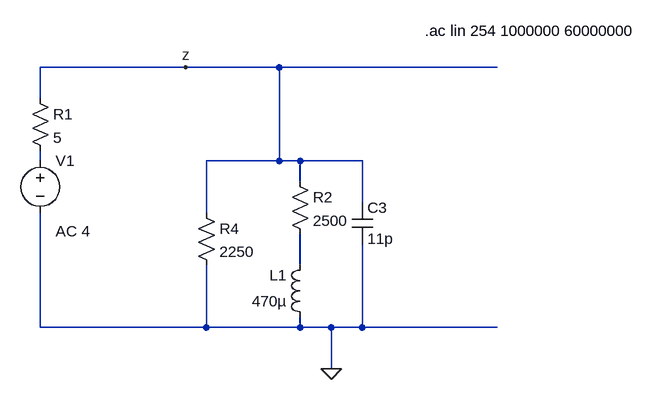
[diagram p0: schematic Output Port Model.asc]
Output Port Model.asc, the LTspice schematic file:
Version 4
SHEET 1 1108 884
WIRE 368 -80 144 -80
WIRE 512 -80 368 -80
WIRE 848 -80 512 -80
WIRE 144 -32 144 -80
WIRE 144 64 144 48
WIRE 512 64 512 -80
WIRE 512 64 400 64
WIRE 544 64 512 64
WIRE 640 64 544 64
WIRE 544 96 544 64
WIRE 640 128 640 64
WIRE 400 144 400 64
WIRE 544 224 544 176
WIRE 144 320 144 144
WIRE 400 320 400 224
WIRE 400 320 144 320
WIRE 544 320 544 304
WIRE 544 320 400 320
WIRE 592 320 544 320
WIRE 640 320 640 192
WIRE 640 320 592 320
WIRE 848 320 640 320
WIRE 592 384 592 320
FLAG 592 384 0
FLAG 368 -80 z
SYMBOL ind 560 320 R180
WINDOW 0 36 80 Left 2
WINDOW 3 36 40 Left 2
SYMATTR InstName L1
SYMATTR Value 470µ
SYMATTR SpiceLine Rser=0.5
SYMBOL res 528 80 R0
SYMATTR InstName R2
SYMATTR Value 2500
SYMBOL res 384 128 R0
SYMATTR InstName R4
SYMATTR Value 2250
SYMBOL cap 624 128 R0
SYMATTR InstName C3
SYMATTR Value 11p
SYMBOL voltage 144 48 R0
WINDOW 123 24 124 Left 2
WINDOW 39 0 0 Left 0
SYMATTR Value2 AC 4
SYMATTR InstName V1
SYMATTR Value ""
SYMBOL res 128 -48 R0
SYMATTR InstName R1
SYMATTR Value 5
TEXT 736 -136 Left 2 !.ac lin 254 1000000 60000000

The netlist it stands for:
* Output Port Model.asc
L1 0 N002 470µ Rser=0.5
R2 z N002 2500
R4 z 0 2250
C3 z 0 11p
V1 N001 0 AC 4
R1 z N001 5
.ac lin 254 1000000 60000000
.backanno
.end